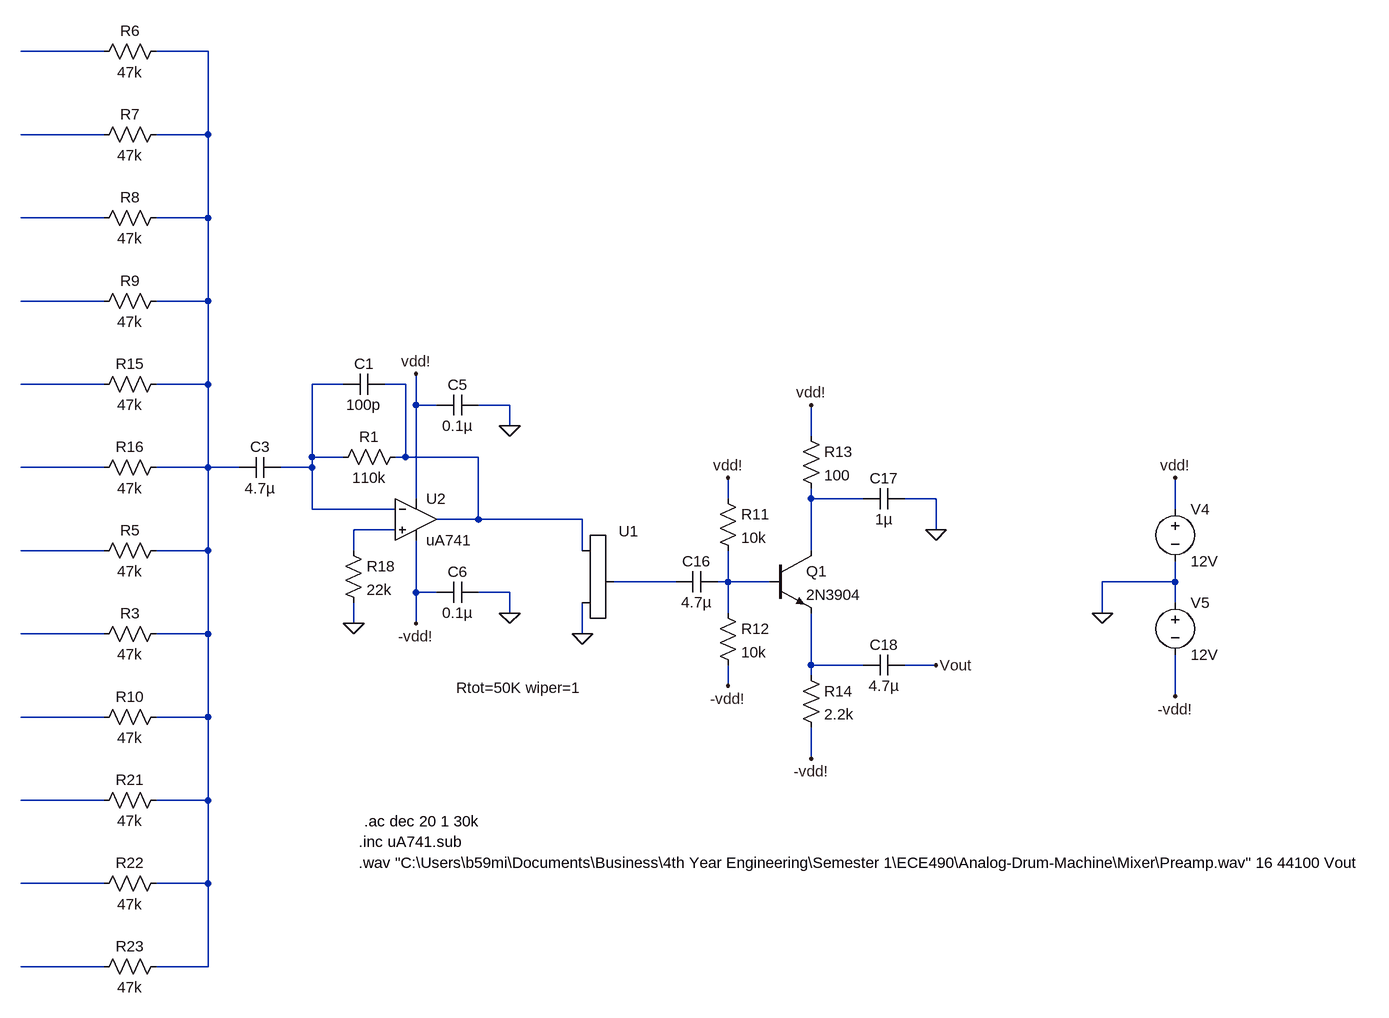
[diagram p0: schematic Combined Stages.asc]
Combined Stages.asc, the LTspice schematic file:
Version 4
SHEET 1 3920 2600
WIRE 1232 -432 1104 -432
WIRE 1392 -432 1312 -432
WIRE 1232 -304 1104 -304
WIRE 1392 -304 1392 -432
WIRE 1392 -304 1312 -304
WIRE 1232 -176 1104 -176
WIRE 1392 -176 1392 -304
WIRE 1392 -176 1312 -176
WIRE 1232 -48 1104 -48
WIRE 1392 -48 1392 -176
WIRE 1392 -48 1312 -48
WIRE 1232 80 1104 80
WIRE 1392 80 1392 -48
WIRE 1392 80 1312 80
WIRE 1600 80 1552 80
WIRE 1696 80 1664 80
WIRE 1712 112 1712 64
WIRE 1744 112 1712 112
WIRE 1856 112 1808 112
WIRE 1856 144 1856 112
WIRE 2320 160 2320 112
WIRE 1552 192 1552 80
WIRE 1600 192 1552 192
WIRE 1696 192 1696 80
WIRE 1696 192 1680 192
WIRE 1808 192 1696 192
WIRE 1232 208 1104 208
WIRE 1392 208 1392 80
WIRE 1392 208 1312 208
WIRE 1440 208 1392 208
WIRE 1552 208 1552 192
WIRE 1552 208 1504 208
WIRE 1712 256 1712 112
WIRE 2192 256 2192 224
WIRE 2320 256 2320 240
WIRE 2400 256 2320 256
WIRE 2512 256 2464 256
WIRE 1552 272 1552 208
WIRE 1680 272 1552 272
WIRE 2880 272 2880 224
WIRE 1808 288 1808 192
WIRE 1808 288 1744 288
WIRE 1968 288 1808 288
WIRE 1680 304 1616 304
WIRE 2512 304 2512 256
WIRE 1232 336 1104 336
WIRE 1392 336 1392 208
WIRE 1392 336 1312 336
WIRE 1616 336 1616 304
WIRE 1968 336 1968 288
WIRE 2320 336 2320 256
WIRE 2112 384 2016 384
WIRE 2192 384 2192 336
WIRE 2192 384 2176 384
WIRE 2256 384 2192 384
WIRE 2880 384 2880 352
WIRE 2880 384 2768 384
WIRE 1712 400 1712 320
WIRE 1744 400 1712 400
WIRE 1856 400 1808 400
WIRE 2880 416 2880 384
WIRE 1856 432 1856 400
WIRE 2192 432 2192 384
WIRE 2768 432 2768 384
WIRE 1616 448 1616 416
WIRE 1712 448 1712 400
WIRE 1232 464 1104 464
WIRE 1392 464 1392 336
WIRE 1392 464 1312 464
WIRE 1968 464 1968 416
WIRE 2320 512 2320 432
WIRE 2400 512 2320 512
WIRE 2512 512 2464 512
WIRE 2320 528 2320 512
WIRE 2192 544 2192 512
WIRE 2880 560 2880 496
WIRE 1232 592 1104 592
WIRE 1392 592 1392 464
WIRE 1392 592 1312 592
WIRE 2320 656 2320 608
WIRE 1232 720 1104 720
WIRE 1392 720 1392 592
WIRE 1392 720 1312 720
WIRE 1232 848 1104 848
WIRE 1392 848 1392 720
WIRE 1392 848 1312 848
WIRE 1232 976 1104 976
WIRE 1392 976 1392 848
WIRE 1392 976 1312 976
FLAG 1616 448 0
FLAG 1856 144 0
FLAG 1712 64 vdd!
FLAG 1712 448 -vdd!
FLAG 1856 432 0
FLAG 2880 224 vdd!
FLAG 2880 560 -vdd!
FLAG 2768 432 0
FLAG 1968 464 0
FLAG 2512 304 0
FLAG 2512 512 Vout
FLAG 2320 112 vdd!
FLAG 2192 224 vdd!
FLAG 2320 656 -vdd!
FLAG 2192 544 -vdd!
SYMBOL cap 1808 96 R90
WINDOW 0 0 32 VBottom 2
WINDOW 3 32 32 VTop 2
SYMATTR InstName C5
SYMATTR Value 0.1µ
SYMBOL cap 1808 384 R90
WINDOW 0 0 32 VBottom 2
WINDOW 3 32 32 VTop 2
SYMATTR InstName C6
SYMATTR Value 0.1µ
SYMBOL voltage 2880 256 R0
WINDOW 123 0 0 Left 0
WINDOW 39 0 0 Left 0
SYMATTR InstName V4
SYMATTR Value 12V
SYMBOL voltage 2880 400 R0
WINDOW 123 0 0 Left 0
WINDOW 39 0 0 Left 0
SYMATTR InstName V5
SYMATTR Value 12V
SYMBOL res 1696 176 R90
WINDOW 0 0 56 VBottom 2
WINDOW 3 32 56 VTop 2
SYMATTR InstName R1
SYMATTR Value 110k
SYMBOL potentiometer_standard 1952 320 R0
WINDOW 3 -178 227 Left 2
SYMATTR Value Rtot=50K wiper=1
SYMATTR InstName U1
SYMATTR SpiceLine ""
SYMBOL Opamps\\opamp2 1712 224 R0
SYMATTR InstName U2
SYMATTR Value uA741
SYMBOL npn 2256 336 R0
SYMATTR InstName Q1
SYMATTR Value 2N3904
SYMBOL cap 2176 368 R90
WINDOW 0 0 32 VBottom 2
WINDOW 3 32 32 VTop 2
SYMATTR InstName C16
SYMATTR Value 4.7µ
SYMBOL res 2176 240 R0
SYMATTR InstName R11
SYMATTR Value 10k
SYMBOL res 2176 416 R0
SYMATTR InstName R12
SYMATTR Value 10k
SYMBOL res 2304 144 R0
SYMATTR InstName R13
SYMATTR Value 100
SYMBOL res 2304 512 R0
SYMATTR InstName R14
SYMATTR Value 2.2k
SYMBOL cap 2464 240 R90
WINDOW 0 0 32 VBottom 2
WINDOW 3 32 32 VTop 2
SYMATTR InstName C17
SYMATTR Value 1µ
SYMBOL cap 2464 496 R90
WINDOW 0 0 32 VBottom 2
WINDOW 3 32 32 VTop 2
SYMATTR InstName C18
SYMATTR Value 4.7µ
SYMBOL res 1328 320 R90
WINDOW 0 0 56 VBottom 2
WINDOW 3 32 56 VTop 2
SYMATTR InstName R5
SYMATTR Value 47k
SYMBOL res 1328 448 R90
WINDOW 0 0 56 VBottom 2
WINDOW 3 32 56 VTop 2
SYMATTR InstName R3
SYMATTR Value 47k
SYMBOL res 1328 576 R90
WINDOW 0 0 56 VBottom 2
WINDOW 3 32 56 VTop 2
SYMATTR InstName R10
SYMATTR Value 47k
SYMBOL res 1328 704 R90
WINDOW 0 0 56 VBottom 2
WINDOW 3 32 56 VTop 2
SYMATTR InstName R21
SYMATTR Value 47k
SYMBOL res 1328 832 R90
WINDOW 0 0 56 VBottom 2
WINDOW 3 32 56 VTop 2
SYMATTR InstName R22
SYMATTR Value 47k
SYMBOL res 1328 960 R90
WINDOW 0 0 56 VBottom 2
WINDOW 3 32 56 VTop 2
SYMATTR InstName R23
SYMATTR Value 47k
SYMBOL res 1328 -448 R90
WINDOW 0 0 56 VBottom 2
WINDOW 3 32 56 VTop 2
SYMATTR InstName R6
SYMATTR Value 47k
SYMBOL res 1328 -320 R90
WINDOW 0 0 56 VBottom 2
WINDOW 3 32 56 VTop 2
SYMATTR InstName R7
SYMATTR Value 47k
SYMBOL res 1328 -192 R90
WINDOW 0 0 56 VBottom 2
WINDOW 3 32 56 VTop 2
SYMATTR InstName R8
SYMATTR Value 47k
SYMBOL res 1328 -64 R90
WINDOW 0 0 56 VBottom 2
WINDOW 3 32 56 VTop 2
SYMATTR InstName R9
SYMATTR Value 47k
SYMBOL res 1328 64 R90
WINDOW 0 0 56 VBottom 2
WINDOW 3 32 56 VTop 2
SYMATTR InstName R15
SYMATTR Value 47k
SYMBOL res 1328 192 R90
WINDOW 0 0 56 VBottom 2
WINDOW 3 32 56 VTop 2
SYMATTR InstName R16
SYMATTR Value 47k
SYMBOL res 1600 320 R0
SYMATTR InstName R18
SYMATTR Value 22k
SYMBOL cap 1504 192 R90
WINDOW 0 0 32 VBottom 2
WINDOW 3 32 32 VTop 2
SYMATTR InstName C3
SYMATTR Value 4.7µ
SYMBOL cap 1664 64 R90
WINDOW 0 0 32 VBottom 2
WINDOW 3 32 32 VTop 2
SYMATTR InstName C1
SYMATTR Value 100p
TEXT 1624 784 Left 2 !.inc uA741.sub
TEXT 1624 816 Left 2 !.wav "C:\\Users\\b59mi\\Documents\\Business\\4th Year Engineering\\Semester 1\\ECE490\\Analog-Drum-Machine\\Mixer\\Preamp.wav" 16 44100 Vout
TEXT 1632 752 Left 2 !.ac dec 20 1 30k

The netlist it stands for:
* Combined Stages.asc
C5 0 vdd! 0.1µ
C6 0 -vdd! 0.1µ
V4 vdd! 0 12V
V5 0 -vdd! 12V
R1 N008 N007 110k
XU1 N008 0 N013 Rtot=50K wiper=1
XU2 N011 N007 vdd! -vdd! N008 uA741  ; pins In+ In- V+ V- OUT
Q1 N010 N014 N016 0 2N3904
C16 N014 N013 4.7µ
R11 vdd! N014 10k
R12 N014 -vdd! 10k
R13 vdd! N010 100
R14 N016 -vdd! 2.2k
C17 0 N010 1µ
C18 Vout N016 4.7µ
R5 N002 N012 47k
R3 N002 N015 47k
R10 N002 N017 47k
R21 N002 N018 47k
R22 N002 N019 47k
R23 N002 N020 47k
R6 N002 N001 47k
R7 N002 N003 47k
R8 N002 N004 47k
R9 N002 N005 47k
R15 N002 N006 47k
R16 N002 N009 47k
R18 N011 0 22k
C3 N007 N002 4.7µ
C1 N008 N007 100p
.model NPN NPN
.model PNP PNP
.lib standard.bjt
.inc uA741.sub
.wav "C:\Users\b59mi\Documents\Business\4th Year Engineering\Semester 1\ECE490\Analog-Drum-Machine\Mixer\Preamp.wav" 16 44100 Vout
.ac dec 20 1 30k
.backanno
.end